# EasyEDA schematic SCH_URM07-Ultrasonic-Sensor_2025-04-24.json
TITLE: URM07 Raspberry Pi 3B+ Integration; REV: 1.0; Date: 2025-04-24; Sheet: 1/1; Drawn By: Mikayel Grigoryan; Company: TUMO Labs
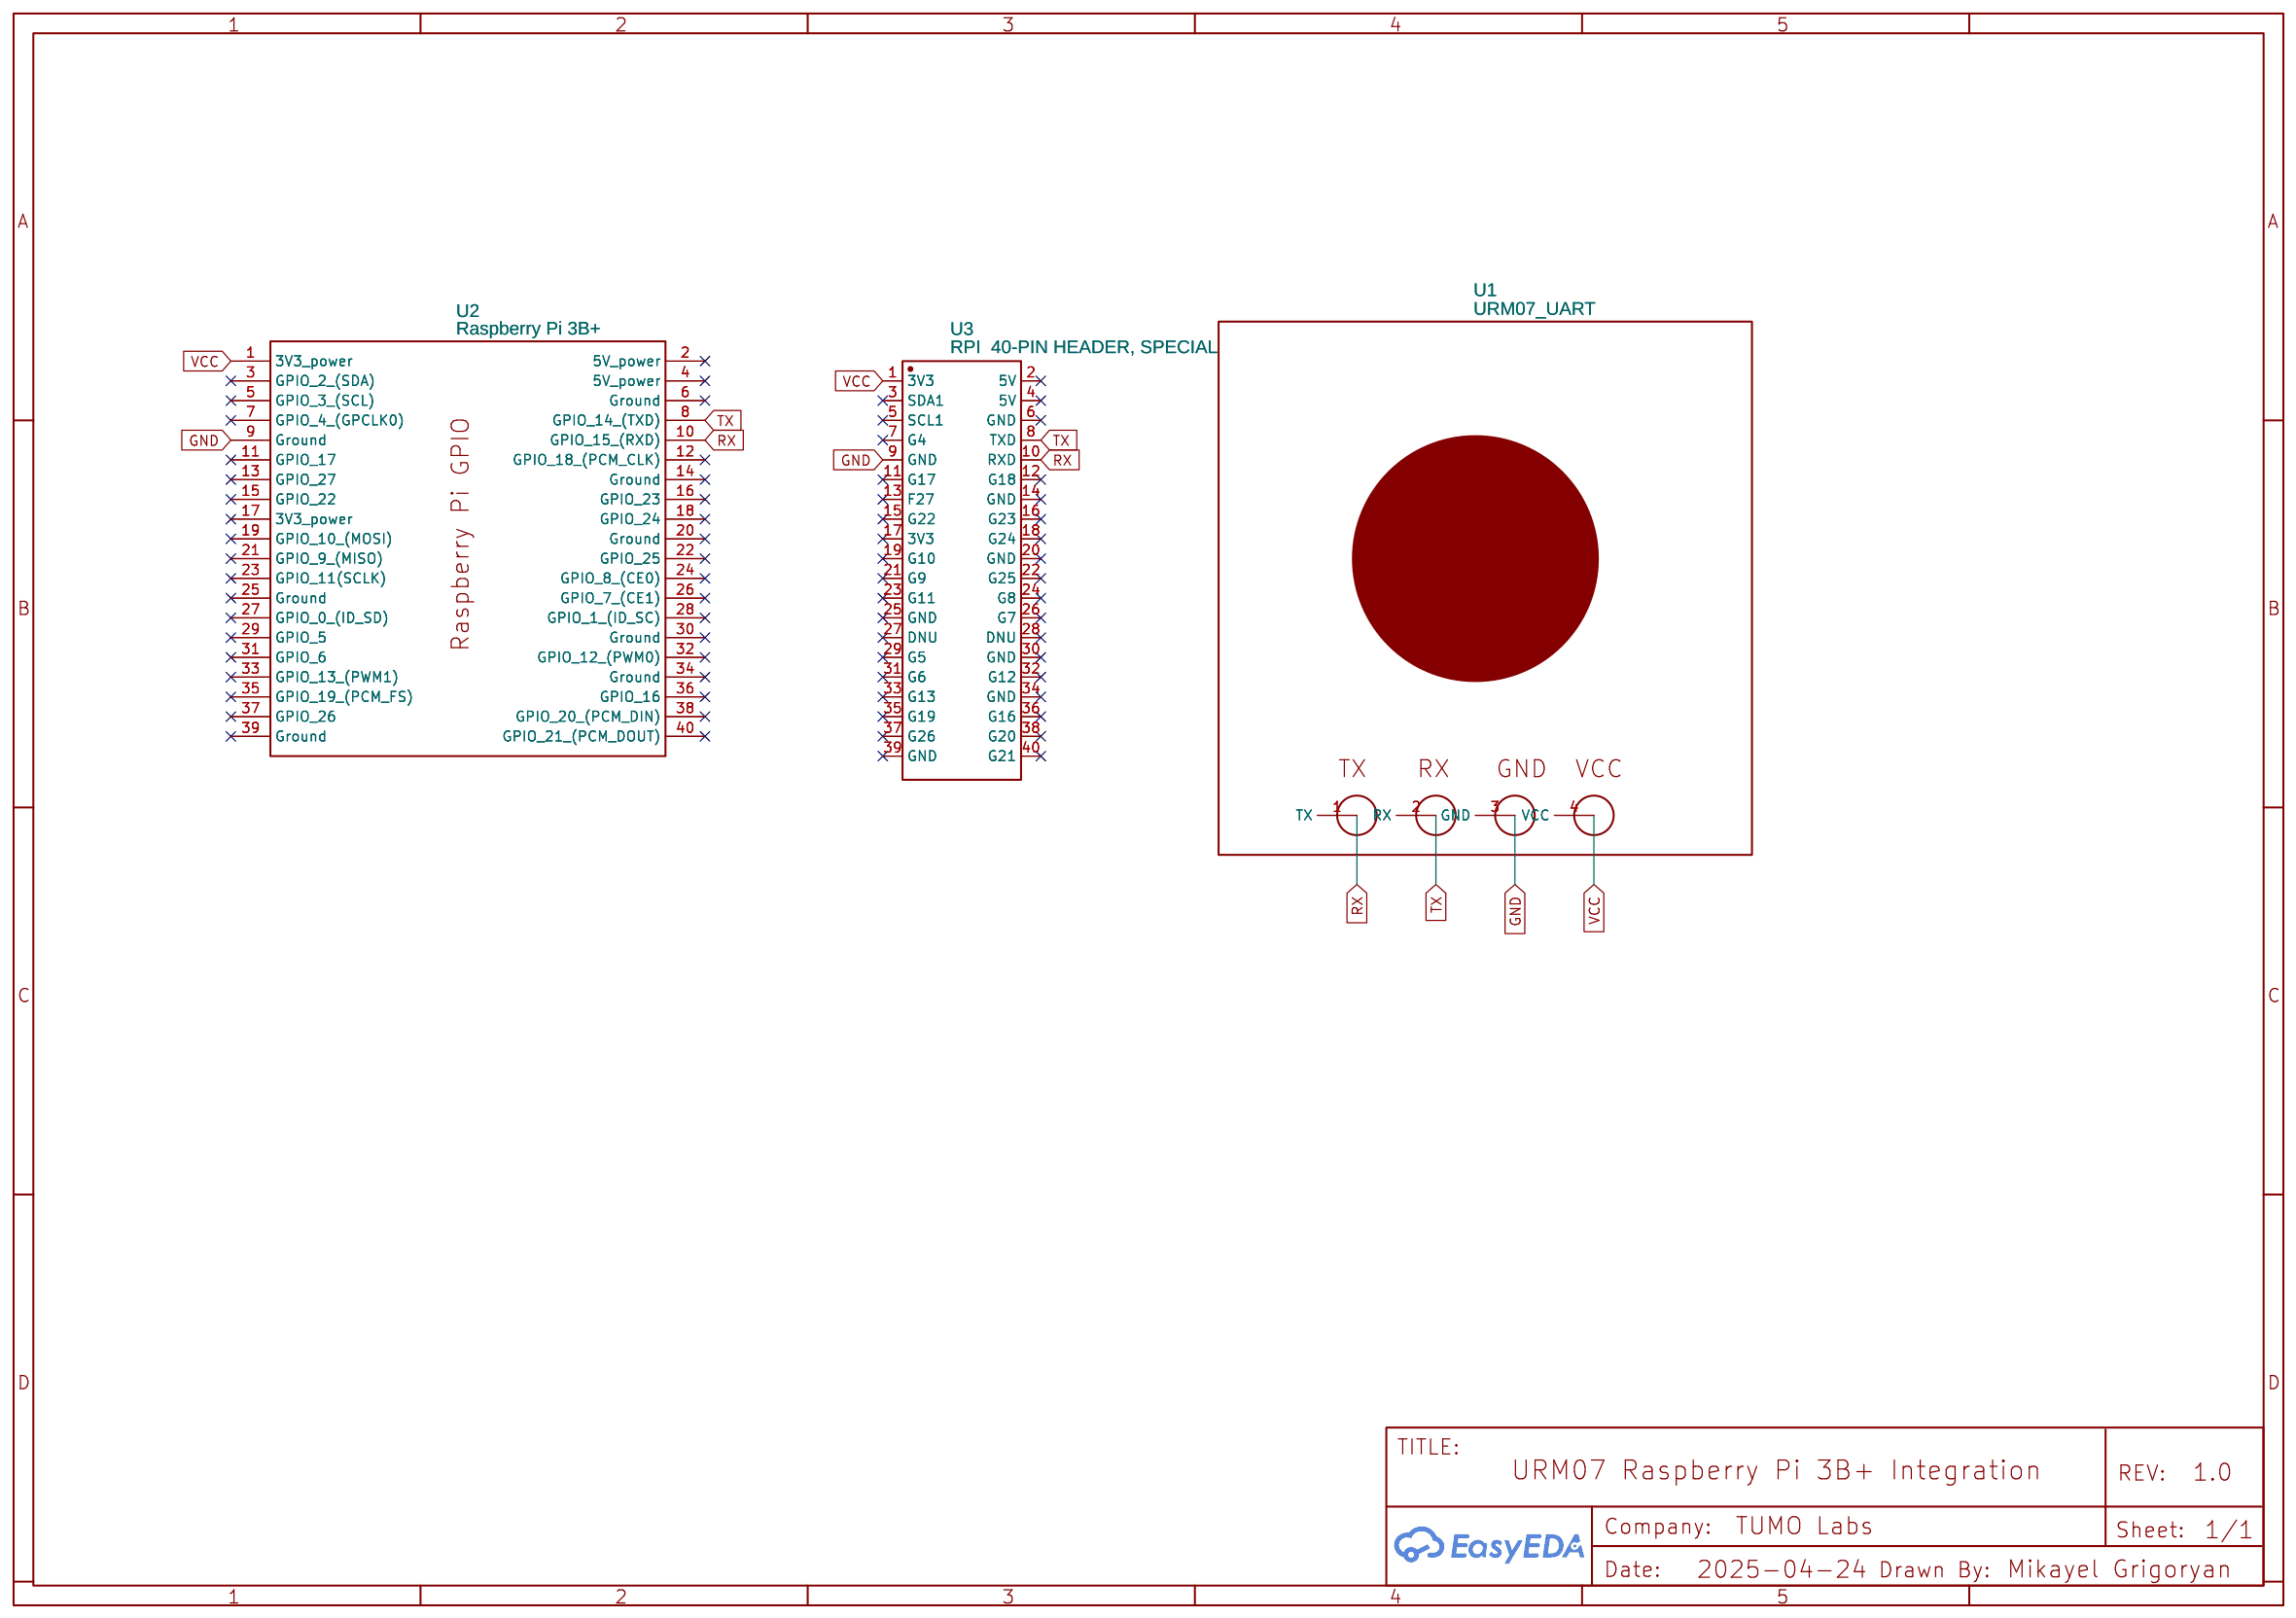
[diagram p0: schematic sheet]

## Parts
U1  URM07_UART  [URM07_MODULE]
U2  Raspberry Pi 3B+  [RASPBERRYPI3B+]
U3  RPI  40-PIN HEADER, SPECIAL  [RPI 40-PIN HEADER]

## Library data of the parts
U1 = URM07_UART: Contributor: michael.grigoryan25
U2 = Raspberry Pi 3B+: Contributor: kritsadakunsiri
U3 = RPI  40-PIN HEADER, SPECIAL: Manufacturer Part: RPi3B-GPIO; Contributor: kmppcdok

## Nets
GND: U1.3(GND) U2.9(Ground) U3.9(GND)
VCC: U1.4(VCC) U2.1(3V3 power) U3.1(3V3)
RX: U1.1(TX) U2.10(GPIO 15 (RXD)) U3.10(RXD)
TX: U1.2(RX) U2.8(GPIO 14 (TXD)) U3.8(TXD)

Not connected (* = marked no-connect by the designer): U2 2(5V power)* 3(GPIO 2 (SDA))* 4(5V power)* 5(GPIO 3 (SCL))* 6(Ground)* 7(GPIO 4 (GPCLK0))* 11(GPIO 17)* 12(GPIO 18 (PCM_CLK))* 13(GPIO 27)* 14(Ground)* 15(GPIO 22)* 16(GPIO 23)* 17(3V3 power)* 18(GPIO 24)* 19(GPIO 10 (MOSI))* 20(Ground)* 21(GPIO 9 (MISO))* 22(GPIO 25)* 23(GPIO 11(SCLK))* 24(GPIO 8 (CE0))* 25(Ground)* 26(GPIO 7 (CE1))* 27(GPIO 0 (ID_SD))* 28(GPIO 1 (ID_SC))* 29(GPIO 5)* 30(Ground)* 31(GPIO 6)* 32(GPIO 12 (PWM0))* 33(GPIO 13 (PWM1))* 34(Ground)* 35(GPIO 19 (PCM_FS))* 36(GPIO 16)* 37(GPIO 26)* 38(GPIO 20 (PCM_DIN))* 39(Ground)* 40(GPIO 21 (PCM_DOUT))*; U3 2(5V)* 3(SDA1)* 4(5V)* 5(SCL1)* 6(GND)* 7(G4)* 11(G17)* 12(G18)* 13(F27)* 14(GND)* 15(G22)* 16(G23)* 17(3V3)* 18(G24)* 19(G10)* 20(GND)* 21(G9)* 22(G25)* 23(G11)* 24(G8)* 25(GND)* 26(G7)* 27(DNU)* 28(DNU)* 29(G5)* 30(GND)* 31(G6)* 32(G12)* 33(G13)* 34(GND)* 35(G19)* 36(G16)* 37(G26)* 38(G20)* 39(GND)* 40(G21)*
